# EAGLE design cmt2300a olimex (EAGLE 7.7.0)
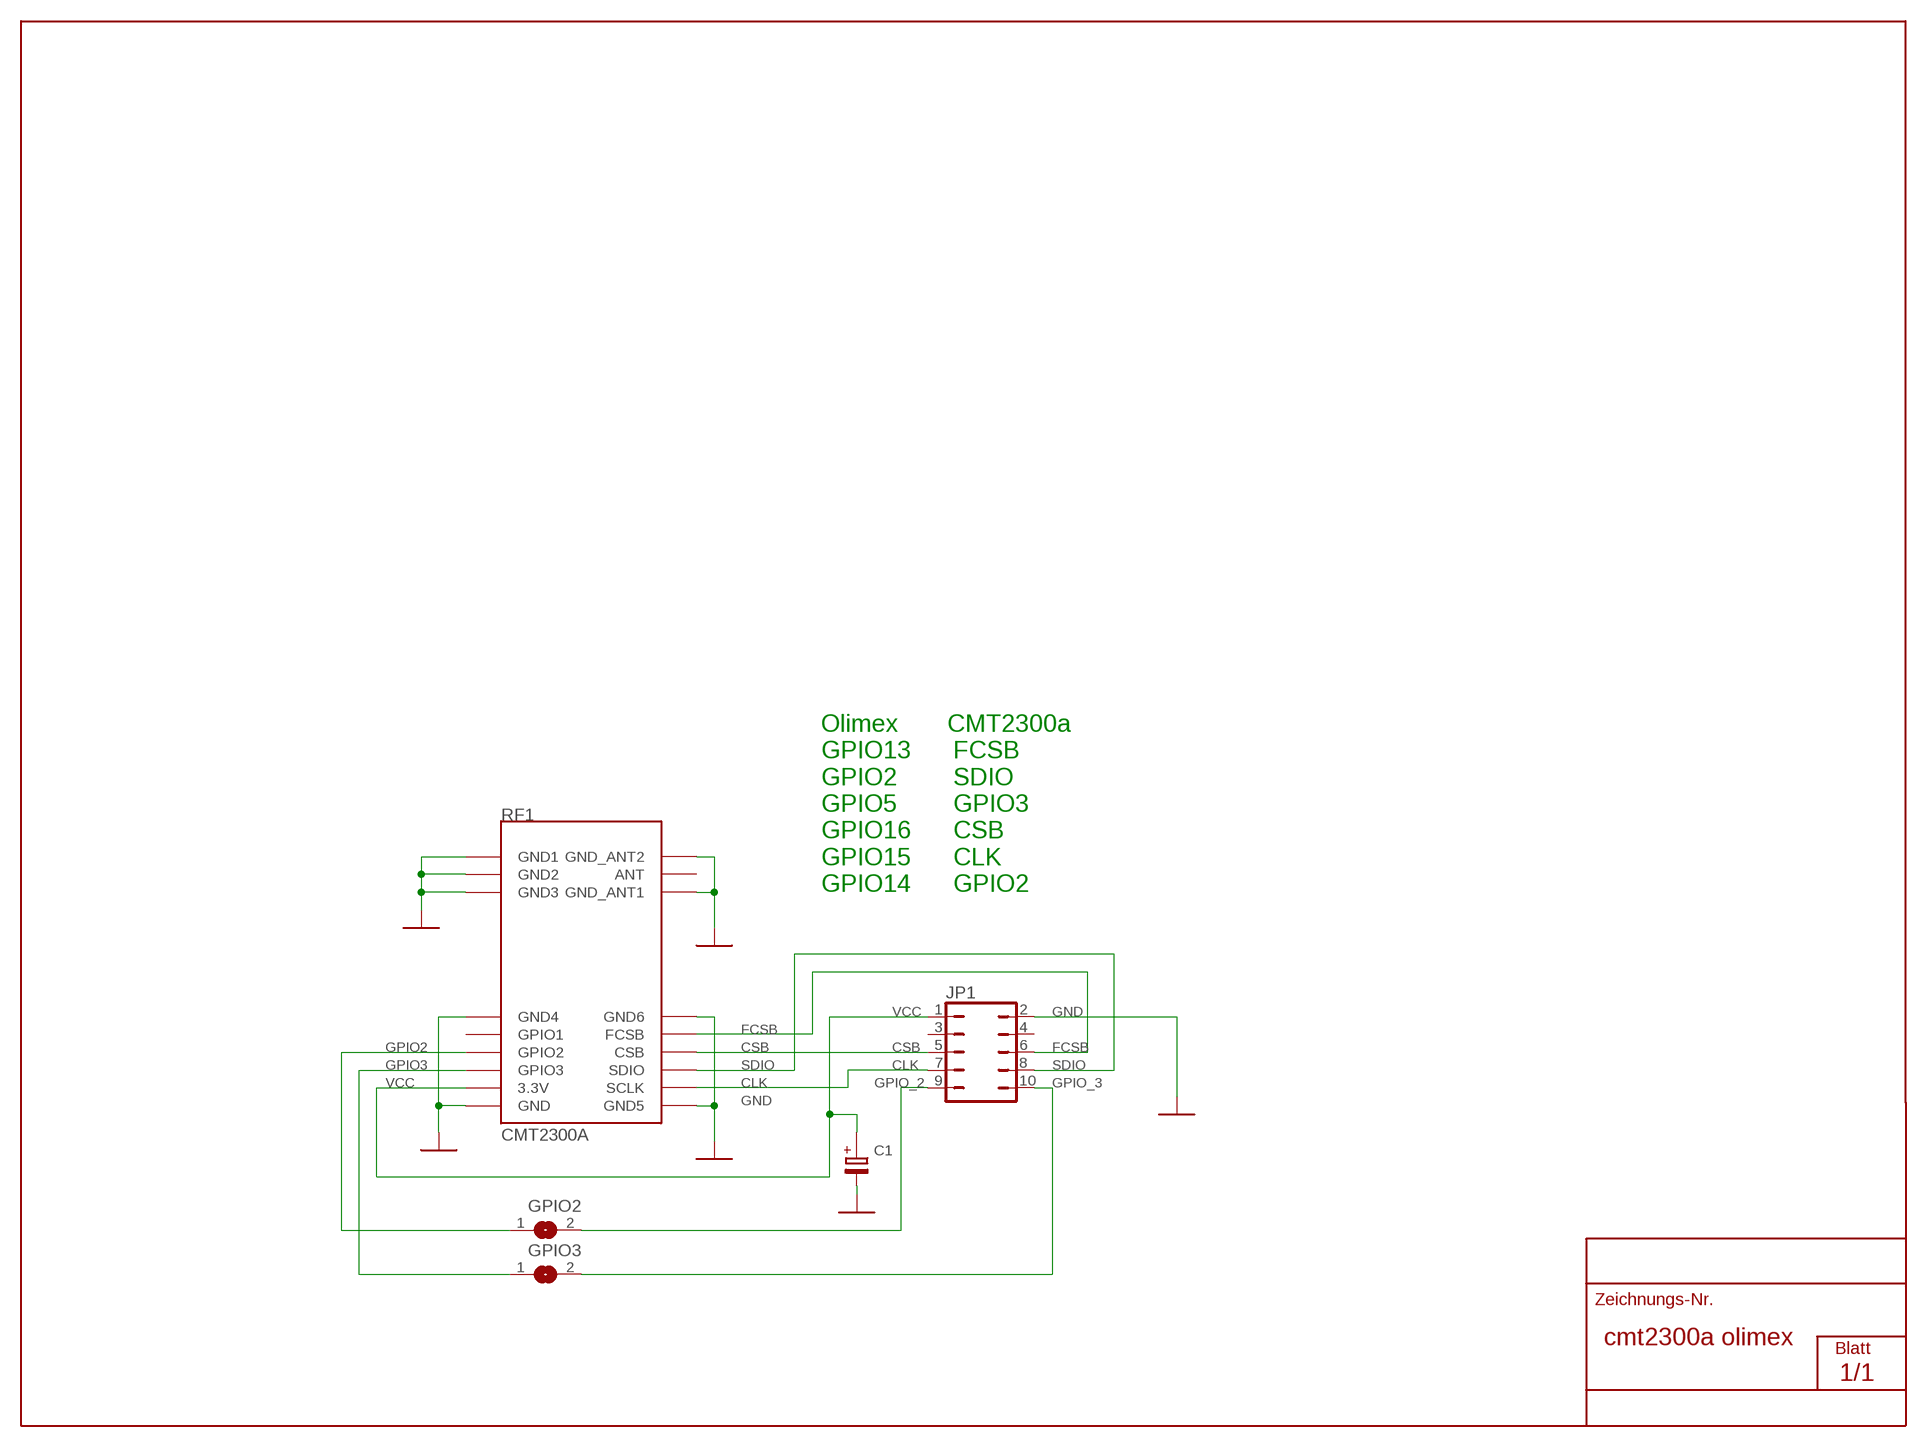
[diagram p0: schematic, sheet 1]

## Parts
C1  S470µ/16  [EB10D]
GPIO2  SJ  [SJ]
GPIO3  SJ  [SJ]
JP1  JP5Q_OT  [JP5Q_OT]
RF1  CMT2300A  [CMT2300A]

## Nets
CLK: JP1.7 RF1.SCLK
CSB: JP1.5 RF1.CSB
FCSB: JP1.6 RF1.FCSB
GND: C1.- JP1.2 RF1.GND RF1.GND1 RF1.GND2 RF1.GND3 RF1.GND4 RF1.GND5 RF1.GND6 RF1.GND_ANT1 RF1.GND_ANT2
GPIO2: GPIO2.1 RF1.GPIO2
GPIO3: GPIO3.1 RF1.GPIO3
GPIO_2: GPIO2.2 JP1.9
GPIO_3: GPIO3.2 JP1.10
SDIO: JP1.8 RF1.SDIO
VCC: C1.+ JP1.1 RF1.3.3V
Unconnected: JP1.3 JP1.4 RF1.ANT RF1.GPIO1

## Notes on the sheet
- Olimex       CMT2300a
  GPIO13      FCSB
  GPIO2        SDIO
  GPIO5        GPIO3
  GPIO16      CSB
  GPIO15      CLK
  GPIO14      GPIO2

## Library data of the parts
C1 = 5elko:S470µ/16
GPIO2 GPIO3 = jumper_fs:SJ: SMD solder JUMPER
JP1 = jumper_fs:JP5Q: JUMPER
RF1 = cmt2300a:CMT2300A

## Board
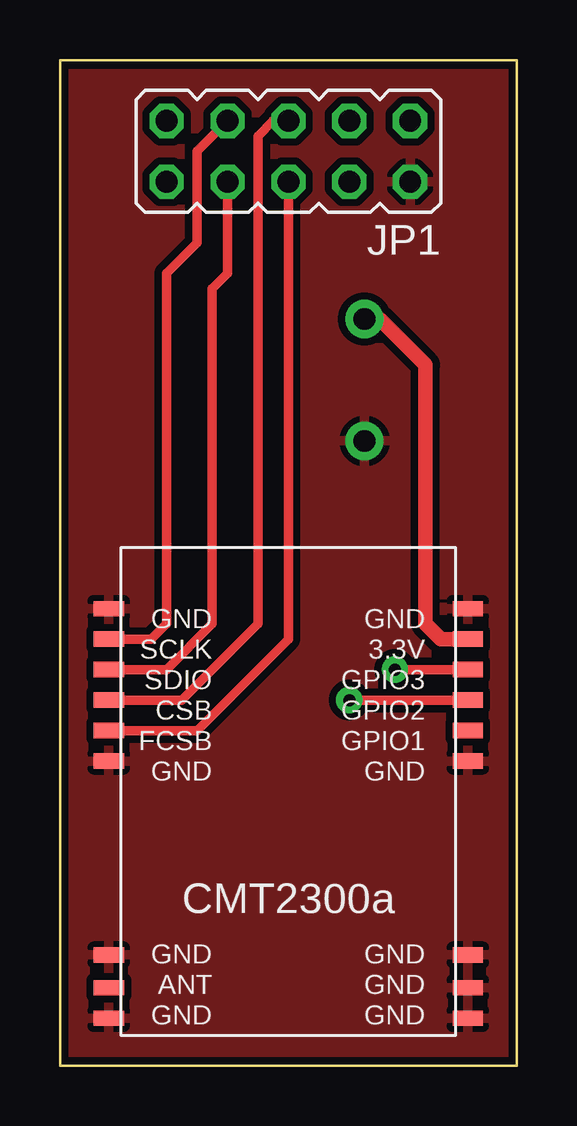
[diagram p1: board, top side]
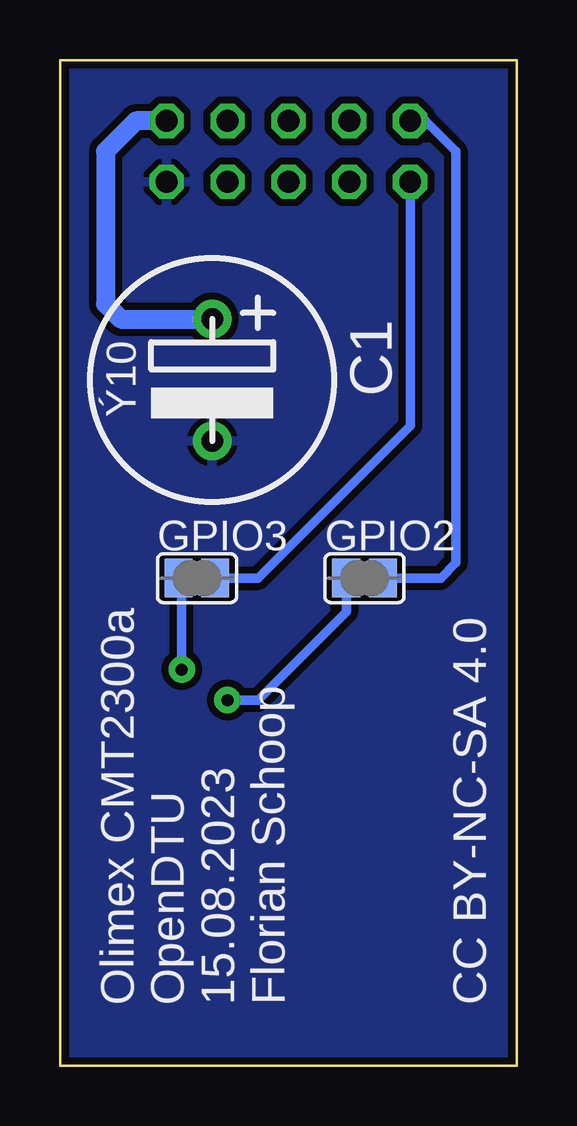
[diagram p2: board, bottom side, seen from below]

Size 19.05 x 41.91 mm. Coordinates in mm from the lower left corner, seen from the top.
Outline: 0,0 0,41.91 19.05,41.91 19.05,0 0,0
Copper layers (1*16): Component 0.035mm / dielectric 1.5mm / Solder 0.035mm
Design rules "default *": minimum track width 10mil, minimum drill 24mil, track to track 8mil, track to pad 8mil, pad to pad 8mil, via to via 8mil, smd to smd 8mil, copper to edge 8mil, drill to drill 8mil, minimum pad ring 10mil, minimum via ring 8mil, stop-mask expansion 4mil, vias tented up to drill 25mil, thermal gap 10mil

### Footprints (pad centres in the part's own frame; a part is rotated, then mirrored left to right if it is on the bottom)
EB10D = drill 0.9 pad 1.6: + -2.54,0; - 2.54,0
SJ = smd 1.168 x 1.6: 1 -0.762,0; 2 0.762,0
JP5Q_OT = drill 0.914 octagon: 1 -5.08,-1.27; 2 -5.08,1.27; 3 -2.54,-1.27; 4 -2.54,1.27; 5 0,-1.27; 6 0,1.27; 7 2.54,-1.27; 8 2.54,1.27; 9 5.08,-1.27; 10 5.08,1.27
CMT2300A = smd 1.27 x 0.635: 3.3V -0.5,2.54; ANT 14.47,17.07; CSB 14.47,5.08; FCSB 14.47,6.35; GND -0.5,1.27; GND1 -0.5,18.34; GND2 -0.5,17.07; GND3 -0.5,15.7; GND4 -0.5,7.62; GND5 14.47,1.27; GND6 14.47,7.62; GND_ANT1 14.47,15.7; GND_ANT2 14.47,18.34; GPIO1 -0.5,6.35; GPIO2 -0.5,5.08; GPIO3 -0.5,3.81; SCLK 14.47,2.54; SDIO 14.47,3.81

### Placement (x,y rotation side)
C1  12.7,28.57 270 bottom
GPIO2  6.35,20.32 0 bottom
GPIO3  13.33,20.32 0 bottom
JP1  9.53,38.1 180 top
RF1  16.51,20.32 180 top

### Tracks (layer width: path | path; a pad name or v marks a point on that pad's centre or on a via)
CLK
  Component 0.4: RF1.SCLK 3.81,17.78 4.45,18.41 4.45,33.02 5.71,34.29 5.71,38.1 JP1.7
CSB
  Component 0.4: JP1.5 8.89,39.37 8.25,38.73 8.25,18.41 5.08,15.24 RF1.CSB
FCSB
  Component 0.4: RF1.FCSB 5.71,13.97 9.53,17.78 JP1.6
GND
  pour Solder (isolate 0.3): 0,41.91 19.05,41.91 19.05,0 0,0
  pour Component (isolate 0.3): 0,41.91 19.05,41.91 19.05,0 0,0
GPIO2  (via drill 0.5 pad 1.1)
  Component 0.4: v12.06,15.24 RF1.GPIO2
  Solder 0.4: GPIO2.1 7.11,18.92 10.79,15.24 v12.06,15.24
GPIO3  (via drill 0.5 pad 1.1)
  Component 0.4: RF1.GPIO3 v13.97,16.51
  Solder 0.4: v13.97,16.51 13.97,20.19 GPIO3.1
GPIO_2
  Solder 0.4: JP1.9 3.81,39.37 2.54,38.1 2.54,20.95 3.17,20.32 GPIO2.2
GPIO_3
  Solder 0.4: GPIO3.2 10.79,20.32 4.45,26.67 JP1.10
SDIO
  Component 0.4: RF1.SDIO 4.45,16.51 6.35,18.41 6.35,32.38 6.99,33.02 JP1.8
VCC
  Component 0.6: RF1.3.3V 15.88,17.78 15.24,18.41 15.24,29.21 13.33,31.11 C1.+
  Solder 0.8: JP1.1 15.88,39.37 17.14,38.1 17.14,31.75 16.51,31.11 C1.+

### Text on the board
bNames: Olimex CMT2300a / OpenDTU / 15.08.2023 / Florian Schoop / / / / CC BY-NC-SA 4.0